# Altium schematic sheet PCB_WeMosD1_IoT.SchDoc
size A3
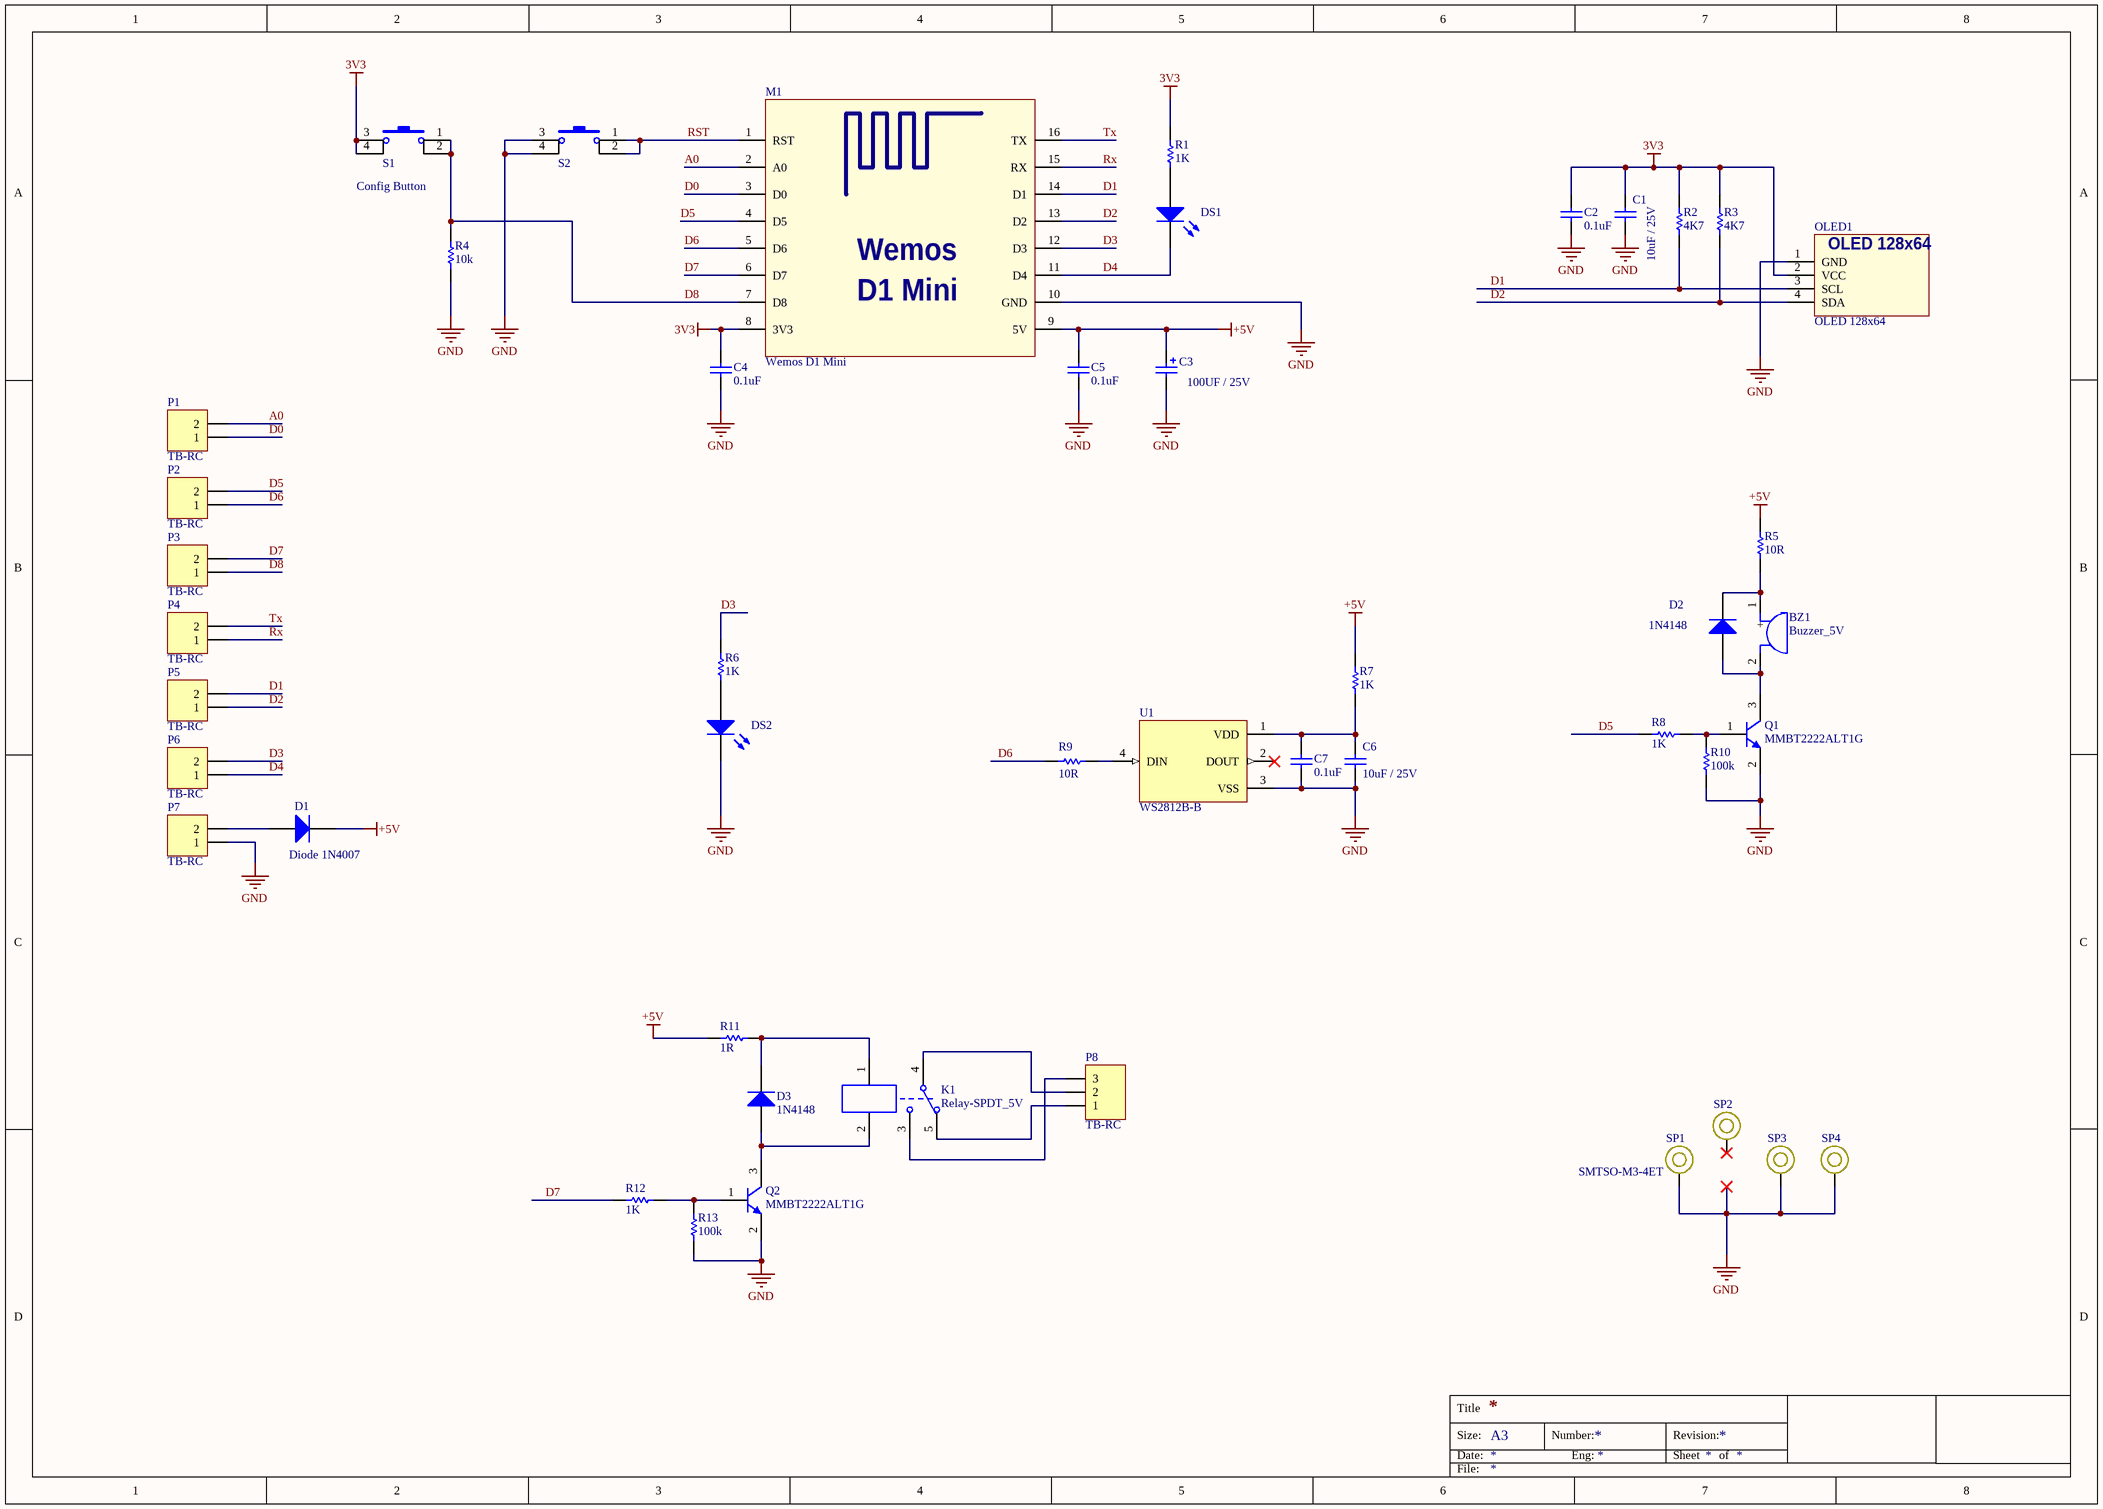
[diagram p0: PCB_WeMosD1_IoT.SchDoc]

## Parts
BZ1  Buzzer_5V  [Buzzer_5V]
C1  10uF / 25V  [CAPC2012L]
C2  value 0.1uF  [CAPC1608L]  (hidden comment: Capacitor Ceramic 0.10uF 10% 16V X7R 0603)
C3  value 100UF / 25V  [100UF / 25V]  (hidden comment: Cap Radial 100UF 25V)
C4  value 0.1uF  [CAPC1608L]  (hidden comment: Capacitor Ceramic 0.10uF 10% 16V X7R 0603)
C5  value 0.1uF  [CAPC1608L]  (hidden comment: Capacitor Ceramic 0.10uF 10% 16V X7R 0603)
C6  10uF / 25V  [CAPC2012L]
C7  value 0.1uF  [CAPC1608L]  (hidden comment: Capacitor Ceramic 0.10uF 10% 16V X7R 0603)
D1  Diode 1N4007  [DO-41]
D2  1N4148  [MELF-D3513-1405]
D3  1N4148  [MELF-D3513-1405]
DS1  LED RED 3MM  [LED Red 3MM]  (value not drawn)
DS2  LED GREEN  [LEDC2012X120N_SML-LXT0805IW-TR(Primary)]  (value not drawn)
K1  Relay-SPDT_5V  [Relay-SPDT_5V]
M1  Wemos D1 Mini  [Wemos D1 Mini]
OLED1  OLED 128x64  [OLED display 128x64]
P1  TB-RC  [2-Pin TB Rising Clamp Vertical]
P2  TB-RC  [2-Pin TB Rising Clamp Vertical]
P3  TB-RC  [2-Pin TB Rising Clamp Vertical]
P4  TB-RC  [2-Pin TB Rising Clamp Vertical]
P5  TB-RC  [2-Pin TB Rising Clamp Vertical]
P6  TB-RC  [2-Pin TB Rising Clamp Vertical]
P7  TB-RC  [2-Pin TB Rising Clamp Vertical]
P8  TB-RC  [3-Pin TB Rising Clamp Vertical]
Q1  MMBT2222ALT1G  [SOT23-3L]
Q2  MMBT2222ALT1G  [SOT23-3L]
R1  value 1K  [RESC1608X05L(0603)]  (hidden comment: Res 0603)
R2  value 4K7  [RESC1608X05L(0603)]  (hidden comment: Res 0603)
R3  value 4K7  [RESC1608X05L(0603)]  (hidden comment: Res 0603)
R4  value 10k  [RESC1608X05L(0603)]  (hidden comment: Res 0603)
R5  value 10R  [RESC1608X05L(0603)]  (hidden comment: Res 0603)
R6  value 1K  [RESC1608X05L(0603)]  (hidden comment: Res 0603)
R7  value 1K  [RESC1608X05L(0603)]  (hidden comment: Res 0603)
R8  value 1K  [RESC1608X05L(0603)]  (hidden comment: Res 0603)
R9  value 10R  [RESC1608X05L(0603)]  (hidden comment: Res 0603)
R10  value 100k  [RESC1608X05L(0603)]  (hidden comment: Res 0603)
R11  value 1R  [RESC3216L]  (hidden comment: Res 1206)
R12  value 1K  [RESC1608X05L(0603)]  (hidden comment: Res 0603)
R13  value 100k  [RESC1608X05L(0603)]  (hidden comment: Res 0603)
S1  SW-PB_TH_9.5MM  [SW_TL1105 SERIES]  (value not drawn)
S2  SW-PB_TH_9.5MM  [SW_TL1105 SERIES]  (value not drawn)
SP1  SMTSO-M3-4ET  [SMTSO_M3]
SP2  SMTSO-M3-4ET  [SMTSO_M3]  (value not drawn)
SP3  SMTSO-M3-4ET  [SMTSO_M3]  (value not drawn)
SP4  SMTSO-M3-4ET  [SMTSO_M3]  (value not drawn)
U1  WS2812B-B  [LED_WS2812B-B]

## Nets
3V3: C1.2 C2.2 C4.2 M1.8(3V3) OLED1.2(VCC) R1.2 R2.1 R3.1 S1.3 S1.4
+5V: C3.1 C5.2 D1.2(K) M1.9(5V) R5.2 R7.1 R11.1
GND: C1.1 C2.1 C3.2 C4.1 C5.1 C6.1 C7.1 DS2.C M1.10(GND) OLED1.1(GND) P7.1 Q1.2(E) Q2.2(E) R4.2 R10.2 R13.2 S2.3 S2.4 SP1.0 SP3.0 SP4.0 U1.3(VSS)
A0: M1.2(A0) P1.2
D0: M1.3(D0) P1.1
D1: M1.14(D1) OLED1.3(SCL) P5.2 R2.2
D2: M1.13(D2) OLED1.4(SDA) P5.1 R3.2
D3: M1.12(D3) P6.2 R6.2
D4: DS1.2(K) M1.11(D4) P6.1
D5: M1.4(D5) P2.2 R8.1
D6: M1.5(D6) P2.1 R9.1
D7: M1.6(D7) P3.2 R12.1
D8: M1.7(D8) P3.1 R4.1 S1.1 S1.2
RST: M1.1(RST) S2.1 S2.2
Rx: M1.15(RX) P4.1
Tx: M1.16(TX) P4.2
NetBZ1_1: BZ1.1(+) D2.2(K) R5.1
NetBZ1_2: BZ1.2(-) D2.1(A) Q1.3(C)
NetC6_2: C6.2 C7.2 R7.2 U1.1(VDD)
NetD1_1: D1.1(A) P7.2
NetD3_1: D3.1(A) K1.2 Q2.3(C)
NetD3_2: D3.2(K) K1.1 R11.2
NetDS1_1: DS1.1(A) R1.1
NetDS2_A: DS2.A R6.1
NetK1_3: K1.3 P8.3
NetK1_4: K1.4 P8.2
NetK1_5: K1.5 P8.1
NetQ1_1: Q1.1(B) R8.2 R10.1
NetQ2_1: Q2.1(B) R12.2 R13.1
NetR9_2: R9.2 U1.4(DIN)

Not connected (* = marked no-connect by the designer): SP2 0*; U1 2(DOUT)*

## Notes on the sheet
- (near S1) Config Button
- Title
- Size:
- Date:
- A3
- Number:
- Eng:
- Revision:
- Sheet
- of
- File:
- (in symbol Wemos_d1_mini_module) Wemos; D1 Mini

## Library data of the parts
BZ1 = Buzzer_5V: Manufacturer: Jiangsu Huaneng Elec; Discription: Magnetic YES 2300±400Hz 85dB @ 5V, 10cm 5V Φ12mm Through Hole 7.62 Buzzers RoHS; MFGPN: TMB12A05; Supplier 1: Digi-Key; Supplier 2: Farnell; Supplier 3: LCSC; Supplier Part Number 3: C96093
C1 C6 = Cap Semi: CAP CER 10UF 16V X5R 0805; Manufacturer: Yageo; MFGPN: CC0805KKX5R8BB106; VPN: 311-1869-1-ND; Vendor: Digi-Key; 1-OSB_Location: M / ex Reel; 2-OSB_Category: C; 3-OSB_Ref_Number: N0040; Discription: 10µF ±10% 25V Ceramic Capacitor X5R 0805 (2012 Metric); Value: 10uF / 25V; PackageReference: CAPC2012X07L(0805); Supplier 1: Digi-Key; Supplier 2: Farnell; Supplier 3: LCSC; Supplier Part Number 1: 311-1869-1-ND; Supplier Part Number 2: 3366590; Supplier Part Number 3: C89831
C2 C4 C5 C7 = Cap Semi_2: Manufacturer: Yageo; MFGPN: CC0603JRX7R8BB104; VPN: 311-1777-1-ND; Vendor: Digi-Key; 1-OSB_Location: M / ex Reel; 2-OSB_Category: C; 3-OSB_Ref_Number: N0039; Discription: 0.1µF ±5% 25V Ceramic Capacitor X7R 0603 (1608 Metric); PackageReference: CAPC1608X08L(0603); Supplier 1: Digi-Key; Supplier 2: Farnell; Supplier 3: LCSC; Supplier Part Number 1: 311-1777-1-ND; Supplier Part Number 3: C327087
C3 = Cap Pol 100UF / 25V: CAP ALUM 100UF 20% 25V RADIAL; Manufacturer: United Chemi-Con; MFGPN: EKZE250ELL101MF11D; Vendor: Mouser; VPN: 661-EKZE250ELL101MF1
D1 = Diode 1N4007: 1 Amp General Purpose Rectifier; 1-OSB_Location: H; 2-OSB_Category: D; 3-OSB_Ref_Number: N0034; Published: 8-Jun-2000; LatestRevisionDate: 17-Jul-2002; LatestRevisionNote: Re-released for DXP Platform.; DatasheetVersion: 1998; PackageVersion: Aug-1999; PackageReference: DO-41; Publisher: Altium Limited; PackageDescription: Diode, Axial; Body 5.2 x 2.7 mm (LxDia. max), Lead Dia. 0.86 mm (max); Code_JEDEC: DO-204-AL; ComponentLink1Description: Manufacturer Link; ComponentLink1URL: http://www.fairchildsemi.com/; ComponentLink2Description: Datasheet; ComponentLink2URL: http://www.fairchildsemi.com/ds/1N%2F1N4001.pdf; MFGPN: 1N4007
D2 D3 = Diode 1N4148: DIODE GEN PURP 100V 200MA SOD80; Manufacturer: ON Semiconductor; MFGPN: LL4148; Value: LL4148; Vendor: Digi-Key; VPN: LL4148FSTR-ND; Discription: Diode Standard 100V 200mA Surface Mount SOD-80; 1-OSB_Location: G / ex Reel; 2-OSB_Category: D; 3-OSB_Ref_Number: N0150; PackageReference: DO-35; Supplier 1: Digi-Key; Supplier 2: Farnell; Supplier Part Number 1: LL4148FSTR-ND; Supplier Part Number 2: 2822552; Supplier 3: LCSC; Supplier Part Number 3: C9808
DS1 = LED_Red_3MM: Value: LED RED; Vendor: Digikey; Supplier 1: Digi-Key
DS2 = LED_Blue: LED GREEN CLEAR 0805 SMD; Manufacturer: Rohm Semiconductor; MFGPN: SML-M13PTT86; VPN: 846-1029-1-ND; Vendor: Digi-Key; Discription: Green 560nm LED Indication - Discrete 2.2V 0805 (2012 Metric); Value: LED GREEN; Supplier 1: Digi-Key; Supplier Part Number 1: 846-1029-1-ND; Supplier 2: Farnell; Supplier 3: LCSC-ALT; Supplier Part Number 3: C688883
K1 = Relay-SPDT: Single-Pole Dual-Throw Relay; MFGPN: TH-T73-DC5V-C-S; Published: 24-Mar-1999; LatestRevisionDate: 17-Jul-2002; LatestRevisionNote: Re-released for DXP Platform.; PackageReference: DIP-P8; Publisher: Altium Limited; PackageDescription: Relay; 8 Leads; Supplier 3: LCSC
M1 = Wemos_d1_mini_module: MFGPN: Wemos_d1_mini_module
OLED1 = OLED_128x64: OLED Display 128x64; MFGPN: SSD1306; Supplier 3: LCSC; Discription: SSD1306
P1-P7 = TB-2_Rising Clamp: TERMINAL BLOCK 5.08MM 2POS PCB Rising Clamp; MFGPN: KF127-5.08-2P
P8 = TB-3_Rising Clamp: TERMINAL BLOCK 5.08MM 3POS PCB Rising Clamp; Manufacturer: Cixi Kefa Elec; MFGPN: KF127-5.08-3P; Supplier 3: LCSC; Supplier Part Number 3: C474907
Q1 = BC849C: TRANS NPN 40V 0.6A SOT23; Manufacturer: ON Semiconductor; VPN: MMBT2222ALT1GOSTR-ND; Vendor: Digi-Key; Discription: Bipolar (BJT) Transistor NPN 40V 600mA 300MHz 225mW Surface Mount SOT-23; 1-OSB_Location: E / ex Reel; 2-OSB_Category: Q; 3-OSB_Ref_Number: N0159; MFGPN: MMBT2222ALT1G; Value: MMBT2222ALT1G; Supplier 1: Digi-Key; Supplier Part Number 1: MMBT2222ALT1GOSTR-ND; Supplier 2: Farnell; Supplier Part Number 2: 1459098; Supplier 3: LCSC; Supplier Part Number 3: C40752
Q2 = BC849C: TRANS NPN 40V 0.6A SOT23; Manufacturer: ON Semiconductor; VPN: MMBT2222ALT1GOSTR-ND; Vendor: Digikey; 1-OSB_Location: E / ex Reel; 2-OSB_Category: Q; 3-OSB_Ref_Number: N0159; Discription: Bipolar (BJT) Transistor NPN 40V 600mA 300MHz 225mW Surface Mount SOT-23; MFGPN: MMBT2222ALT1G; Value: MMBT2222ALT1G; Supplier 3: LCSC; Supplier Part Number 3: C40752; Supplier 1: Digi-Key; Supplier 2: Farnell; Supplier Part Number 1: MMBT2222ALT1GOSTR-ND; Supplier Part Number 2: 1459098
R1 R6-R8 R12 = Res1: RES SMD 1K OHM 1% 1/10W 0603; Manufacturer: Yageo; MFGPN: RC0603FR-071KL; Vendor: Digi-Key; VPN: 311-1.00KHRCT-ND; Discription: 1 kOhms ±1% 0.1W, 1/10W Chip Resistor 0603 (1608 Metric) Moisture Resistant Thick Film; PackageReference: RESC1608X05L(0603); Supplier 1: Digi-Key; Supplier 2: Farnell; Supplier Part Number 1: 311-1.00KHRCT-ND; Supplier Part Number 2: 9238484
R2 R3 = Res1: RES SMD 4.7K OHM 1% 1/10W 0603; Manufacturer: Yageo; MFGPN: RC0603FR-074K7L; Vendor: Digi-Key; VPN: 311-4.70KHRCT-ND; Discription: 4.7 kOhms ±1% 0.1W, 1/10W Chip Resistor 0603 (1608 Metric) Moisture Resistant Thick Film; 1-OSB_Location: J; 2-OSB_Category: R; 3-OSB_Ref_Number: N0060; PackageReference: RESC1608X05L(0603); Supplier 1: Digi-Key; Supplier 2: Farnell; Supplier Part Number 1: 311-4.70KHRCT-ND; Supplier Part Number 2: 9238565; Supplier 3: LCSC; Supplier Part Number 3: C99782
R4 = Res1: RES SMD 10K OHM 1% 1/10W 0603; Manufacturer: Yageo; MFGPN: RC0603FR-0710KL; Vendor: Digi-Key; VPN: 311-10.0KHRCT-ND; Discription: 10 kOhms ±1% 0.1W, 1/10W Chip Resistor 0603 (1608 Metric) Moisture Resistant Thick Film; 1-OSB_Location: K / ex Reel; 2-OSB_Category: R; 3-OSB_Ref_Number: N0111; PackageReference: RESC1608X05L(0603); Supplier 1: Digi-Key; Supplier 2: Farnell; Supplier Part Number 1: 311-10.0KHRCT-ND; Supplier Part Number 2: 9238603
R5 R9 = Res1: RES SMD 10OHM 1% 1/10W 0603; Manufacturer: Yageo; MFGPN: RC0603FR-0710RL; Vendor: Digi-Key; 1-OSB_Location: I; 2-OSB_Category: R; 3-OSB_Ref_Number: N0050; PackageReference: RESC1608X05L(0603); Supplier 1: Digi-Key; Supplier 2: Farnell; Supplier 3: LCSC; Supplier Part Number 3: C109318
R10 R13 = Res1: RES SMD 100K OHM 5% 1/10W 0603; Manufacturer: Yageo; MFGPN: RC0603FR-07100KL; Vendor: Digikey; VPN: 311-100KHRCT-ND; Discription: ±1% 0.1W, 1/10W Chip Resistor 0603 (1608 Metric) Moisture Resistant Thick Film; 1-OSB_Location: I / ex Reel; 2-OSB_Category: R; 3-OSB_Ref_Number: N0048; Supplier 3: LCSC; Supplier 1: Digi-Key; Supplier 2: Farnell; Supplier Part Number 1: 311-100KHRCT-ND; Supplier Part Number 3: C14675
R11 = Res1: RES SMD 1 OHM 1% 1/4W 1206; Manufacturer: Yageo; MFGPN: RC1206FR-071RL; Vendor: Digi-Key; VPN: 311-1.00FRCT-ND; Discription: 1 Ohms ±1% 0.25W, 1/4W Chip Resistor 1206 (3216 Metric) Moisture Resistant Thick Film; 1-OSB_Location: J / ex Reel; 2-OSB_Category: R; 3-OSB_Ref_Number: N0062; PackageReference: RESC3216L; Supplier 1: Digi-Key; Supplier 2: Farnell; Supplier Part Number 1: 311-1.00FRCT-ND; Supplier Part Number 2: 9236520; Supplier 3: LCSC; Supplier Part Number 3: C137355
S1 S2 = SW-PB_TH_9.5MM: SWITCH TACTILE SPST-NO 0.05A 12V 9.5MM; Manufacturer: E-Switch; MFGPN: TL1105BF100Q; VPN: EG2497-ND; Vendor: Digikey; Supplier 1: Digi-Key; Supplier Part Number 1: EG2497-ND; Supplier 3: LCSC
SP1-SP4 = SMTSO-M3-4ET: Standoffs & Spacers SMTSO, M3, THRU-HOLE, CRS, ET; Manufacturer: PEM; Discription: Standoffs & Spacers SMTSO, M3, THRU-HOLE, CRS, ET; MFGPN: SMTSO-M3-4ET; Supplier 1: Digi-Key; Supplier 2: Farnell; Supplier 3: LCSC; Value: SMTSO-M3-4ET
U1 = WS2812B-B: Intelligent control LED integrated light source; MF: Worldsemi; SnapEDA_Link: https://www.snapeda.com/parts/WS2812B-B/Worldsemi/view-part/5799638/?ref=snap; Package: Package; Check_prices: https://www.snapeda.com/parts/WS2812B-B/Worldsemi/view-part/5799638/?ref=eda; Availability: Unavailable; Price: None; MP: WS2812B-B; Value: *; MFGPN: WS2812B-B